# EAGLE design PCB-MicroSmartH (EAGLE 7.5.0)
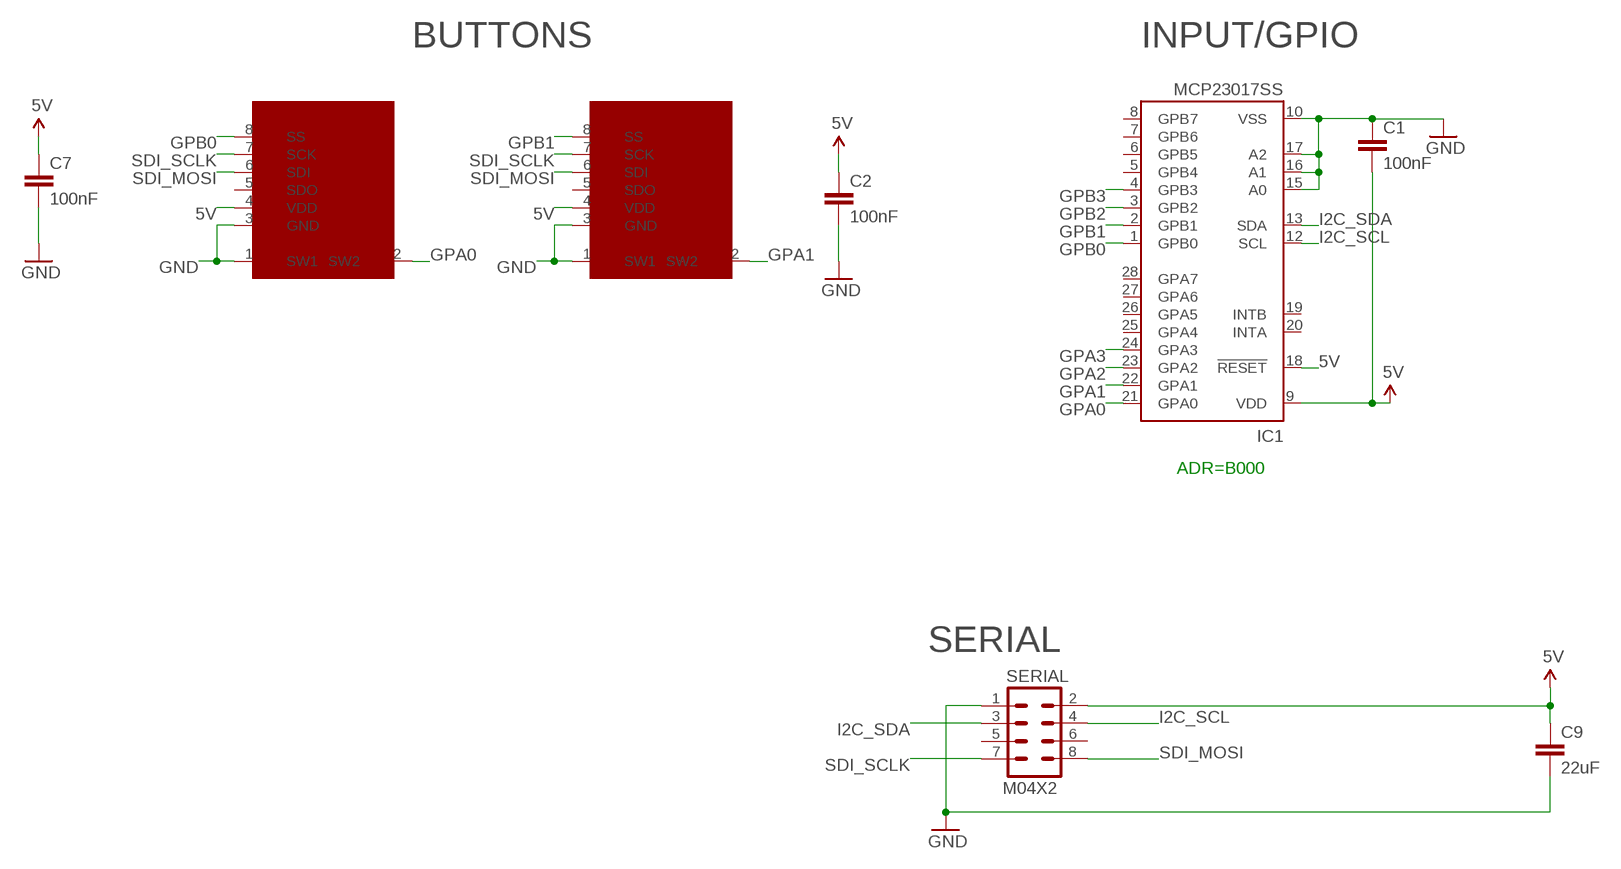
[diagram p0: schematic, sheet 1]

## Parts
C1  100nF  CAP0603-CAP  [0603-CAP]
C2  100nF  CAP0603-CAP  [0603-CAP]
C7  100nF  CAP0603-CAP  [0603-CAP]
C9  22uF  CAP0805  [0805]
IC1  MCP23017SS  [SSOP28]
SERIAL  M04X2  [2X4]
SSW1  SMART_SWITCHSMART_SWITCH_8PIN  [SMART_SWITCH]
SSW2  SMART_SWITCHSMART_SWITCH_8PIN  [SMART_SWITCH]

## Nets
5V [Power]: C1.2 C2.1 C7.1 C9.1 IC1.9(VDD) IC1.18(!RESET) SERIAL.2 SSW1.4(VDD) SSW2.4(VDD)
GND [Power]: C1.1 C2.2 C7.2 C9.2 IC1.10(VSS) IC1.15(A0) IC1.16(A1) IC1.17(A2) SERIAL.1 SSW1.1(SW1) SSW1.3(GND) SSW2.1(SW1) SSW2.3(GND)
GPA0: IC1.21(GPA0) SSW1.2(SW2)
GPA1: IC1.22(GPA1) SSW2.2(SW2)
GPA2: IC1.23(GPA2)
GPA3: IC1.24(GPA3)
GPB0: IC1.1(GPB0) SSW1.8(SS)
GPB1: IC1.2(GPB1) SSW2.8(SS)
GPB2: IC1.3(GPB2)
GPB3: IC1.4(GPB3)
I2C_SCL: IC1.12(SCL) SERIAL.4
I2C_SDA: IC1.13(SDA) SERIAL.3
SDI_MOSI: SERIAL.8 SSW1.6(SDI) SSW2.6(SDI)
SDI_SCLK: SERIAL.7 SSW1.7(SCK) SSW2.7(SCK)
Unconnected: IC1.5(GPB4) IC1.6(GPB5) IC1.7(GPB6) IC1.8(GPB7) IC1.19(INTB) IC1.20(INTA) IC1.25(GPA4) IC1.26(GPA5) IC1.27(GPA6) IC1.28(GPA7) SERIAL.5 SERIAL.6 SSW1.5(SDO) SSW2.5(SDO)

## Notes on the sheet
- BUTTONS | INPUT/GPIO
- ADR=B000
- SERIAL

## Library data of the parts
C1 C2 C7 C9 = SparkFun:CAP: Capacitor Standard 0603 ceramic capacitor, and 0.1" leaded capacitor.
IC1 = microchip:MCP23017: http://ww1.microchip.com/downloads/en/DeviceDoc/21952a.pdf Source: http://ww1.microchip.com/downloads/en/DeviceDoc/21952a.pdf; MF: MICROCHIP; MPN: MCP23017-E/SS; OC_FARNELL: 1467674; OC_NEWARK: 31K2960
SERIAL = SparkFun:M04X2
SSW1 SSW2 = SKAARHOJ:SMART_SWITCH: SMARTSWITCH IS15DSBFP4RGB www.nkksmartswitch.com

## Net classes
0 default: width 0.203 mm, drill 0.406 mm, clearance 0.203 mm
1 Power: width 0.406 mm, drill 0.61 mm, clearance 0.203 mm

## Board
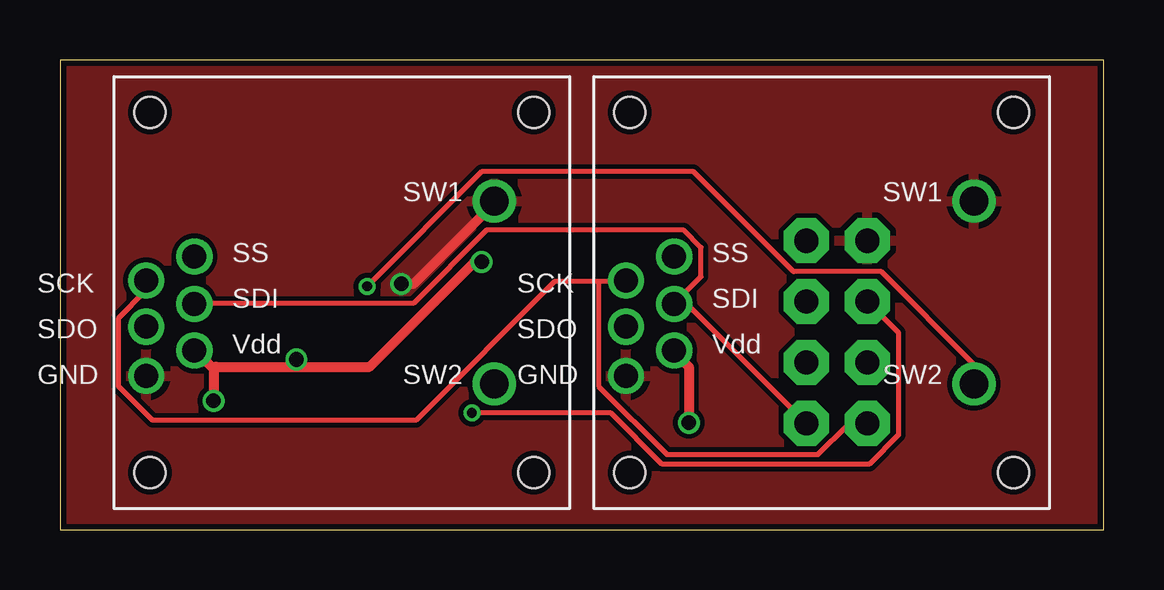
[diagram p1: board, top side]
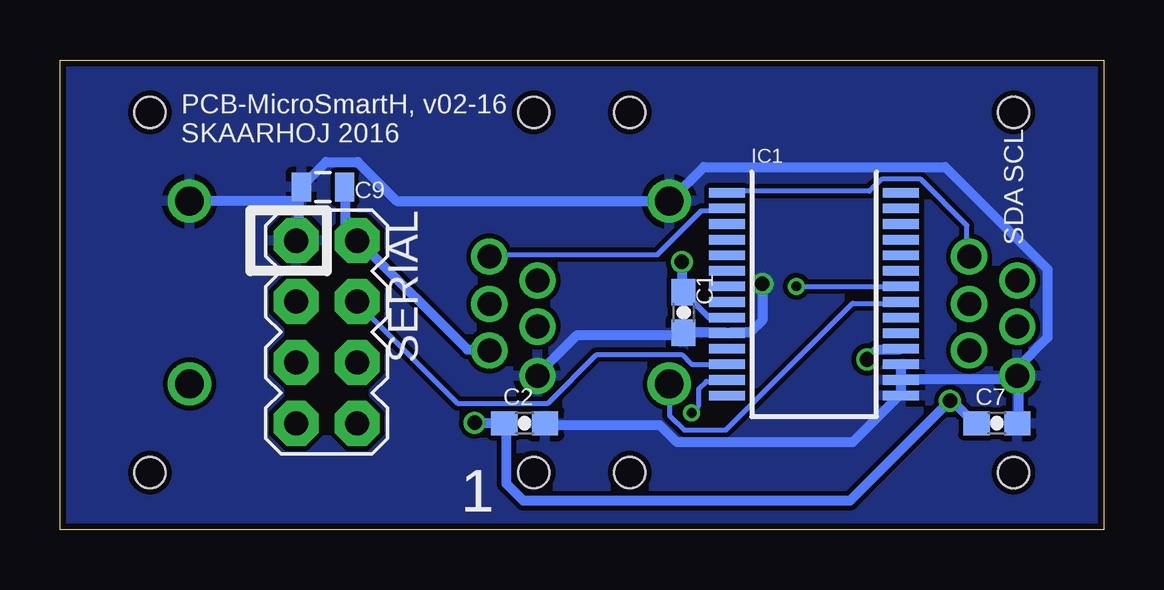
[diagram p2: board, bottom side, seen from below]

Size 43.5 x 19.6 mm. Coordinates in mm from the lower left corner, seen from the top.
Outline: 0,0 43.5,0 43.5,19.6 0,19.6 0,0
Copper layers (1*16): Top 0.035mm / dielectric 1.5mm / Bottom 0.035mm
Design rules "Fusion_eagle_rule_v1.1": minimum track width 6mil, minimum drill 12mil, track to track 6mil, track to pad 6mil, pad to pad 6mil, via to via 6mil, smd to smd 0mil, copper to edge 10mil, drill to drill 10mil, minimum pad ring 10mil, minimum via ring 6mil, stop-mask expansion 2mil, vias tented up to drill 100mil, thermal gap 10mil

### Footprints (pad centres in the part's own frame; a part is rotated, then mirrored left to right if it is on the bottom)
0603-CAP = smd 1.1 x 1: 1 -0.85,0; 2 0.85,0
0805 = smd 0.8 x 1.2: 1 -0.9,0; 2 0.9,0
SSOP28 = smd 0.4 x 1.5: 1 -4.225,-3.625; 2 -3.575,-3.625; 3 -2.925,-3.625; 4 -2.275,-3.625; 5 -1.625,-3.625; 6 -0.975,-3.625; 7 -0.325,-3.625; 8 0.325,-3.625; 9 0.975,-3.625; 10 1.625,-3.625; 11 2.275,-3.625; 12 2.925,-3.625; 13 3.575,-3.625; 14 4.225,-3.625; 15 4.225,3.625; 16 3.575,3.625; 17 2.925,3.625; 18 2.275,3.625; 19 1.625,3.625; 20 0.975,3.625; 21 0.325,3.625; 22 -0.325,3.625; 23 -0.975,3.625; 24 -1.625,3.625; 25 -2.275,3.625; 26 -2.925,3.625; 27 -3.575,3.625; 28 -4.225,3.625
2X4 = drill 1.016 pad 1.88 octagon: 1 -3.81,-1.27; 2 -3.81,1.27; 3 -1.27,-1.27; 4 -1.27,1.27; 5 1.27,-1.27; 6 1.27,1.27; 7 3.81,-1.27; 8 3.81,1.27
SMART_SWITCH = drill 1.2: 1 6.35,3.81; 2 6.35,-3.81 | drill 1: 3 -8.153,-3.48; 4 -6.147,-2.413; 5 -8.153,-1.422; 6 -6.147,-0.483; 7 -8.153,0.508; 8 -6.147,1.499 | hole 1.3: -8.001,7.506; 8.001,7.506; 8.001,-7.506; -8.001,-7.506

### Placement (x,y rotation side)
C1  17.5,9.07 90 bottom
C2  24.13,4.45 0 bottom
C7  4.45,4.45 0 bottom
C9  32.54,14.3 180 bottom
IC1  12.06,9.83 270 bottom
SERIAL  32.38,8.26 270 bottom
SSW1  11.75,9.9 0 top
SSW2  31.75,9.9 0 top

### Tracks (layer width: path | path; a pad name or v marks a point on that pad's centre or on a via)
5V  (via drill 0.61)
  Top 0.406: v26.21,4.47 26.21,6.81 25.6,7.42 SSW2.4 | 6.4,6.71 v6.4,5.38 | 6.4,6.71 5.69,7.42 SSW1.4 | v17.58,11.18 17.27,11.18 12.9,6.81 9.86,6.81 | 9.86,6.81 6.5,6.81 6.4,6.71 | 9.86,6.81 v9.86,7.11
  Bottom 0.254: IC1.9 16.44,8.86 C1.2
  Bottom 0.406: v26.21,4.47 24.99,4.47 C2.1 24.89,4.27 24.89,1.93 24.18,1.22 10.57,1.22 v6.4,5.38 6.3,5.38 5.38,4.47 C7.1 | C9.1 31.6,14.22 31.6,12.5 31.19,12.09 SERIAL.2 30.99,11.99 26.52,7.52 25.6,7.52 SSW2.4 | v17.58,11.18 17.58,9.96 C1.2 | v9.86,7.11 9.45,7.52 8.53,7.52 IC1.18
GND  (via drill 0.61)
  Top 0.406: v14.22,10.26 14.73,10.26 18.09,13.61 SSW1.1
  Bottom 0.406: C7.2 3.56,4.47 3.56,6.4 SSW1.3 | C2.2 23.27,4.37 18.49,4.37 17.78,3.66 10.46,3.66 8.53,5.59 IC1.15 8.43,5.79 8.43,6.2 IC1.16 | IC1.17 8.43,6.81 8.43,6.4 IC1.16 | SSW1.3 3.76,6.3 8.33,6.3 IC1.16 | SSW2.3 23.57,6.5 21.95,8.13 17.68,8.13 C1.1 17.48,8.23 15.75,8.23 IC1.10 15.54,8.23 14.73,8.23 14.22,8.74 v14.22,10.26 | SERIAL.1 33.53,12.19 33.53,14.22 C9.2 | C9.2 33.33,14.43 32.41,15.34 31.09,15.34 29.46,13.72 18.19,13.72 SSW1.1 17.98,13.82 16.66,15.14 6.6,15.14 2.34,10.87 2.34,8.03 3.56,6.81 3.56,6.6 SSW1.3 | SSW2.1 33.63,13.72 C9.2
  pour Top: 0,0 43.81,0 43.81,19.68 0,19.68
  pour Bottom: 0,0 43.81,0 43.81,19.68 0,19.68
GPA0
  Bottom 0.203: IC1.21 8.53,9.45 10.46,9.45 15.75,4.17 17.48,4.17 18.09,4.78 18.09,5.99 SSW1.2
GPA1  (via drill 0.41)
  Top 0.203: v12.8,10.16 17.58,14.94 26.42,14.94 30.58,10.77 34.24,10.77 38.1,6.91 SSW2.2
  Bottom 0.203: v12.8,10.16 8.53,10.16 IC1.22
GPB0
  Bottom 0.203: IC1.1 15.65,14.12 9.75,14.12 9.25,14.63 7.62,14.63 5.69,12.7 5.69,11.48 SSW1.8
GPB1
  Bottom 0.203: IC1.2 15.75,13.31 16.76,13.31 18.59,11.48 25.6,11.48 SSW2.8
I2C_SCL
  Bottom 0.203: IC1.12 15.75,6.91 17.17,6.91 17.58,7.32 21.13,7.32 23.16,5.28 26.92,5.28 31.09,9.45 SERIAL.4
I2C_SDA  (via drill 0.41)
  Top 0.203: v17.17,4.88 22.96,4.88 25.09,2.74 33.73,2.74 34.95,3.96 34.95,8.23 SERIAL.3
  Bottom 0.203: v17.17,4.88 16.87,5.18 16.87,5.89 16.56,6.2 15.75,6.2 IC1.13
SDI_MOSI
  Top 0.203: SSW1.6 5.69,9.45 14.73,9.45 17.78,12.5 26.01,12.5 26.72,11.79 26.72,10.57 25.6,9.45 SSW2.6 25.91,9.65 SERIAL.8
SDI_SCLK
  Top 0.203: 22.45,10.36 23.57,10.36 SSW2.7 | 22.45,10.36 20.62,10.36 14.83,4.57 3.86,4.57 2.44,5.99 2.44,8.84 3.56,9.96 3.56,10.36 SSW1.7 | 22.45,10.36 22.45,5.99 25.3,3.15 31.6,3.15 32.82,4.37 33.63,4.37 SERIAL.7

### Text on the board
_bsilk: PCB-MicroSmartH, v02-16 / SKAARHOJ 2016 | SCL | SDA | 1